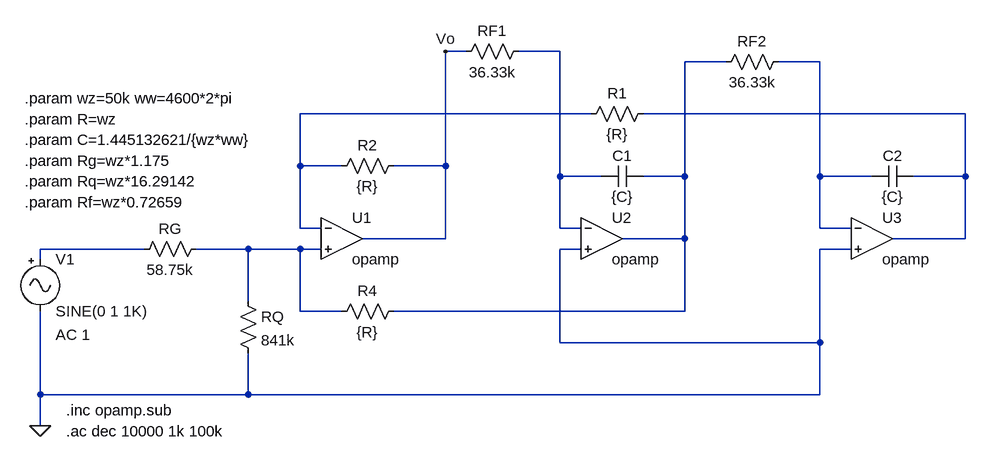
[diagram p0: schematic Filtro_UAF42.asc]
Filtro_UAF42.asc, the LTspice schematic file:
Version 4
SHEET 1 1412 680
WIRE 560 -240 528 -240
WIRE 704 -240 640 -240
WIRE 960 -224 896 -224
WIRE 1104 -224 1040 -224
WIRE 752 -144 304 -144
WIRE 1328 -144 832 -144
WIRE 304 -64 304 -144
WIRE 368 -64 304 -64
WIRE 528 -64 528 -240
WIRE 528 -64 448 -64
WIRE 704 -48 704 -240
WIRE 768 -48 704 -48
WIRE 896 -48 896 -224
WIRE 896 -48 832 -48
WIRE 1104 -48 1104 -224
WIRE 1184 -48 1104 -48
WIRE 1328 -48 1328 -144
WIRE 1328 -48 1248 -48
WIRE 304 32 304 -64
WIRE 336 32 304 32
WIRE 704 32 704 -48
WIRE 736 32 704 32
WIRE 1104 32 1104 -48
WIRE 1152 32 1104 32
WIRE 528 48 528 -64
WIRE 528 48 400 48
WIRE 896 48 896 -48
WIRE 896 48 800 48
WIRE 1328 48 1328 -48
WIRE 1328 48 1216 48
WIRE 64 64 -96 64
WIRE 224 64 144 64
WIRE 304 64 224 64
WIRE 336 64 304 64
WIRE 736 64 704 64
WIRE 1152 64 1104 64
WIRE -96 80 -96 64
WIRE 224 144 224 64
WIRE 304 160 304 64
WIRE 368 160 304 160
WIRE 896 160 896 48
WIRE 896 160 448 160
WIRE 704 208 704 64
WIRE 1104 208 1104 64
WIRE 1104 208 704 208
WIRE -96 288 -96 160
WIRE 224 288 224 224
WIRE 224 288 -96 288
WIRE 1104 288 1104 208
WIRE 1104 288 224 288
WIRE -96 336 -96 288
FLAG -96 336 0
FLAG 528 -240 Vo
SYMBOL Misc\\signal -96 64 R0
WINDOW 123 24 132 Left 2
WINDOW 39 0 0 Left 0
SYMATTR Value2 AC 1
SYMATTR InstName V1
SYMBOL res 160 48 R90
WINDOW 0 0 56 VBottom 2
WINDOW 3 32 56 VTop 2
SYMATTR InstName RG
SYMATTR Value 58.75k
SYMBOL res 208 128 R0
SYMATTR InstName RQ
SYMATTR Value 841k
SYMBOL OpAmps\\opamp 368 -16 R0
SYMATTR InstName U1
SYMBOL res 464 144 R90
WINDOW 0 0 56 VBottom 2
WINDOW 3 32 56 VTop 2
SYMATTR InstName R4
SYMATTR Value {R}
SYMBOL res 464 -80 R90
WINDOW 0 0 56 VBottom 2
WINDOW 3 32 56 VTop 2
SYMATTR InstName R2
SYMATTR Value {R}
SYMBOL res 656 -256 R90
WINDOW 0 0 56 VBottom 2
WINDOW 3 32 56 VTop 2
SYMATTR InstName RF1
SYMATTR Value 36.33k
SYMBOL res 848 -160 R90
WINDOW 0 0 56 VBottom 2
WINDOW 3 32 56 VTop 2
SYMATTR InstName R1
SYMATTR Value {R}
SYMBOL OpAmps\\opamp 768 -16 R0
SYMATTR InstName U2
SYMBOL cap 832 -64 R90
WINDOW 0 0 32 VBottom 2
WINDOW 3 32 32 VTop 2
SYMATTR InstName C1
SYMATTR Value {C}
SYMBOL res 1056 -240 R90
WINDOW 0 0 56 VBottom 2
WINDOW 3 32 56 VTop 2
SYMATTR InstName RF2
SYMATTR Value 36.33k
SYMBOL OpAmps\\opamp 1184 -16 R0
SYMATTR InstName U3
SYMBOL cap 1248 -64 R90
WINDOW 0 0 32 VBottom 2
WINDOW 3 32 32 VTop 2
SYMATTR InstName C2
SYMATTR Value {C}
TEXT -56 344 Left 2 !.ac dec 10000 1k 100k
TEXT -56 312 Left 2 !.inc opamp.sub
TEXT -120 -136 Left 2 !.param R=wz
TEXT -120 -168 Left 2 !.param wz=50k ww=4600*2*pi
TEXT -120 -104 Left 2 !.param C=1.445132621/{wz*ww}
TEXT -120 -72 Left 2 !.param Rg=wz*1.175
TEXT -120 -40 Left 2 !.param Rq=wz*16.29142
TEXT -120 -8 Left 2 !.param Rf=wz*0.72659

The netlist it stands for:
* Filtro_UAF42.asc
V1 N006 0 SINE(0 1 1K) AC 1
RG N007 N006 58.75k
RQ N007 0 841k
XU1 N004 N007 Vo opamp Aol=100K GBW=10Meg  ; pins invin noninvin out
R4 N002 N007 {R}
R2 Vo N004 {R}
RF1 N001 Vo 36.33k
R1 N005 N004 {R}
XU2 N001 0 N002 opamp Aol=100K GBW=10Meg  ; pins invin noninvin out
C1 N002 N001 {C}
RF2 N003 N002 36.33k
XU3 N003 0 N005 opamp Aol=100K GBW=10Meg  ; pins invin noninvin out
C2 N005 N003 {C}
.ac dec 10000 1k 100k
.inc opamp.sub
.param R=wz
.param wz=50k ww=4600*2*pi
.param C=1.445132621/{wz*ww}
.param Rg=wz*1.175
.param Rq=wz*16.29142
.param Rf=wz*0.72659
.backanno
.end